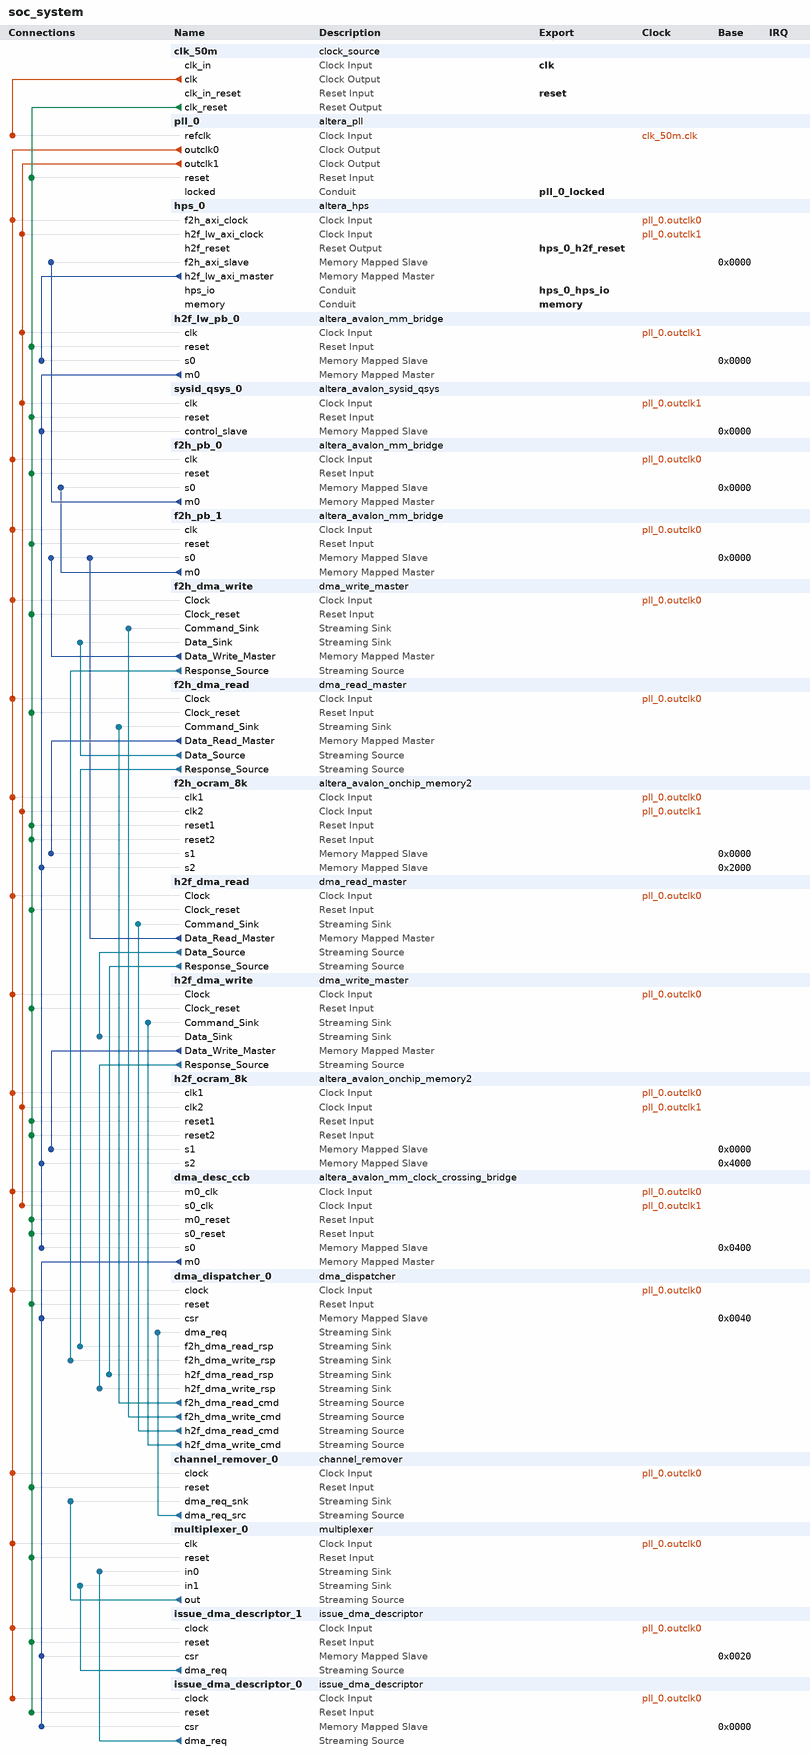
[diagram p0: system contents]
# Platform Designer (Qsys) system soc_system, Cyclone V 5CSXFC6D6F31C8ES
# Parameters at their usual value, and those the tool derives, are not listed.
package require -exact qsys 13.0
create_system soc_system
set_project_property DEVICE_FAMILY {Cyclone V}
set_project_property DEVICE 5CSXFC6D6F31C8ES

add_instance clk_50m clock_source 13.0
set_instance_parameter_value clk_50m clockFrequency 50000000

add_instance pll_0 altera_pll 13.0
set_instance_parameter_value pll_0 gui_device_speed_grade 8
set_instance_parameter_value pll_0 gui_pll_mode {Integer-N PLL}
set_instance_parameter_value pll_0 gui_reference_clock_frequency 50.0
set_instance_parameter_value pll_0 gui_operation_mode normal
set_instance_parameter_value pll_0 gui_use_locked true
set_instance_parameter_value pll_0 gui_number_of_clocks 2
set_instance_parameter_value pll_0 gui_output_clock_frequency0 150.0
set_instance_parameter_value pll_0 gui_output_clock_frequency1 131.25
set_instance_parameter_value pll_0 gui_actual_output_clock_frequency1 {140.0 MHz}
set_instance_parameter_value pll_0 gui_phase_shift_deg1 0

add_instance hps_0 altera_hps 13.0.1
set_instance_parameter_value hps_0 MEM_VENDOR JEDEC
set_instance_parameter_value hps_0 MEM_ROW_ADDR_WIDTH 15
set_instance_parameter_value hps_0 MEM_COL_ADDR_WIDTH 10
set_instance_parameter_value hps_0 MEM_DQ_WIDTH 40
set_instance_parameter_value hps_0 MEM_BANKADDR_WIDTH 3
set_instance_parameter_value hps_0 MEM_DRV_STR RZQ/6
set_instance_parameter_value hps_0 MEM_RTT_NOM RZQ/6
set_instance_parameter_value hps_0 MEM_RTT_WR {Dynamic ODT off}
set_instance_parameter_value hps_0 MEM_WTCL 6
set_instance_parameter_value hps_0 MEM_TCL 7
set_instance_parameter_value hps_0 TIMING_TIS 170
set_instance_parameter_value hps_0 TIMING_TIH 120
set_instance_parameter_value hps_0 TIMING_TDS 10
set_instance_parameter_value hps_0 TIMING_TDH 45
set_instance_parameter_value hps_0 TIMING_TDQSQ 100
set_instance_parameter_value hps_0 TIMING_TDQSCK 225
set_instance_parameter_value hps_0 TIMING_TDQSS 0.27
set_instance_parameter_value hps_0 TIMING_TQSH 0.4
set_instance_parameter_value hps_0 TIMING_TDSH 0.18
set_instance_parameter_value hps_0 TIMING_TDSS 0.18
set_instance_parameter_value hps_0 MEM_TRAS_NS 35.0
set_instance_parameter_value hps_0 MEM_TRCD_NS 13.75
set_instance_parameter_value hps_0 MEM_TRP_NS 13.75
set_instance_parameter_value hps_0 MEM_TRFC_NS 260.0
set_instance_parameter_value hps_0 MEM_TFAW_NS 30.0
set_instance_parameter_value hps_0 MEM_TRRD_NS 10.0
set_instance_parameter_value hps_0 MEM_TRTP_NS 10.0
set_instance_parameter_value hps_0 REF_CLK_FREQ 25.0
set_instance_parameter_value hps_0 DEFAULT_FAST_SIM_MODEL true
set_instance_parameter_value hps_0 TIMING_BOARD_MAX_CK_DELAY 0.6
set_instance_parameter_value hps_0 TIMING_BOARD_MAX_DQS_DELAY 0.6
set_instance_parameter_value hps_0 TIMING_BOARD_SKEW_CKDQS_DIMM_MIN -0.01
set_instance_parameter_value hps_0 TIMING_BOARD_SKEW_CKDQS_DIMM_MAX 0.01
set_instance_parameter_value hps_0 TIMING_BOARD_SKEW_WITHIN_DQS 0.02
set_instance_parameter_value hps_0 TIMING_BOARD_SKEW_BETWEEN_DQS 0.02
set_instance_parameter_value hps_0 TIMING_BOARD_DQ_TO_DQS_SKEW 0.0
set_instance_parameter_value hps_0 TIMING_BOARD_AC_SKEW 0.02
set_instance_parameter_value hps_0 TIMING_BOARD_AC_TO_CK_SKEW 0.0
set_instance_parameter_value hps_0 MEM_CLK_FREQ 400.0
set_instance_parameter_value hps_0 HPS_PROTOCOL DDR3
set_instance_parameter_value hps_0 STM_Enable false
set_instance_parameter_value hps_0 F2S_Width 3
set_instance_parameter_value hps_0 S2F_Width 0
set_instance_parameter_value hps_0 LWH2F_Enable true
set_instance_parameter_value hps_0 F2SCLK_DBGRST_Enable false
set_instance_parameter_value hps_0 F2SCLK_WARMRST_Enable false
set_instance_parameter_value hps_0 F2SCLK_COLDRST_Enable false
set_instance_parameter_value hps_0 F2SINTERRUPT_Enable false
set_instance_parameter_value hps_0 EMAC1_PinMuxing {HPS I/O Set 0}
set_instance_parameter_value hps_0 EMAC1_Mode RGMII
set_instance_parameter_value hps_0 QSPI_PinMuxing {HPS I/O Set 0}
set_instance_parameter_value hps_0 QSPI_Mode {1 SS}
set_instance_parameter_value hps_0 SDIO_PinMuxing {HPS I/O Set 0}
set_instance_parameter_value hps_0 SDIO_Mode {4-bit Data}
set_instance_parameter_value hps_0 USB1_PinMuxing {HPS I/O Set 0}
set_instance_parameter_value hps_0 USB1_Mode SDR
set_instance_parameter_value hps_0 SPIM0_PinMuxing {HPS I/O Set 0}
set_instance_parameter_value hps_0 SPIM0_Mode {Single Slave Select}
set_instance_parameter_value hps_0 SPIM1_PinMuxing Unused
set_instance_parameter_value hps_0 SPIM1_Mode N/A
set_instance_parameter_value hps_0 UART0_PinMuxing {HPS I/O Set 2}
set_instance_parameter_value hps_0 UART0_Mode {No Flow Control}
set_instance_parameter_value hps_0 I2C0_PinMuxing {HPS I/O Set 1}
set_instance_parameter_value hps_0 I2C0_Mode I2C
set_instance_parameter_value hps_0 I2C1_PinMuxing Unused
set_instance_parameter_value hps_0 I2C1_Mode N/A
set_instance_parameter_value hps_0 CAN0_PinMuxing {HPS I/O Set 0}
set_instance_parameter_value hps_0 CAN0_Mode CAN
set_instance_parameter_value hps_0 TRACE_PinMuxing {HPS I/O Set 0}
set_instance_parameter_value hps_0 TRACE_Mode HPS
set_instance_parameter_value hps_0 S2FCLK_USER1CLK_FREQ 100
set_instance_parameter_value hps_0 FPGA_PERIPHERAL_OUTPUT_CLOCK_FREQ_EMAC0_MD_CLK 100
set_instance_parameter_value hps_0 FPGA_PERIPHERAL_OUTPUT_CLOCK_FREQ_EMAC0_GTX_CLK 100
set_instance_parameter_value hps_0 FPGA_PERIPHERAL_OUTPUT_CLOCK_FREQ_EMAC1_MD_CLK 100
set_instance_parameter_value hps_0 FPGA_PERIPHERAL_OUTPUT_CLOCK_FREQ_EMAC1_GTX_CLK 100
set_instance_parameter_value hps_0 quartus_ini_hps_ip_enable_loanio false

add_instance h2f_lw_pb_0 altera_avalon_mm_bridge 13.0
set_instance_parameter_value h2f_lw_pb_0 DATA_WIDTH 32
set_instance_parameter_value h2f_lw_pb_0 ADDRESS_WIDTH 16
set_instance_parameter_value h2f_lw_pb_0 ADDRESS_UNITS SYMBOLS
set_instance_parameter_value h2f_lw_pb_0 MAX_PENDING_RESPONSES 32

add_instance sysid_qsys_0 altera_avalon_sysid_qsys 13.0
set_instance_parameter_value sysid_qsys_0 id 1297045074

add_instance f2h_pb_0 altera_avalon_mm_bridge 13.0
set_instance_parameter_value f2h_pb_0 DATA_WIDTH 128
set_instance_parameter_value f2h_pb_0 ADDRESS_WIDTH 32
set_instance_parameter_value f2h_pb_0 ADDRESS_UNITS SYMBOLS
set_instance_parameter_value f2h_pb_0 MAX_BURST_SIZE 16
set_instance_parameter_value f2h_pb_0 MAX_PENDING_RESPONSES 32

add_instance f2h_pb_1 altera_avalon_mm_bridge 13.0
set_instance_parameter_value f2h_pb_1 DATA_WIDTH 128
set_instance_parameter_value f2h_pb_1 ADDRESS_WIDTH 32
set_instance_parameter_value f2h_pb_1 ADDRESS_UNITS SYMBOLS
set_instance_parameter_value f2h_pb_1 MAX_BURST_SIZE 16
set_instance_parameter_value f2h_pb_1 MAX_PENDING_RESPONSES 32

add_instance f2h_dma_write dma_write_master 1.0
set_instance_parameter_value f2h_dma_write DATA_WIDTH 128
set_instance_parameter_value f2h_dma_write LENGTH_WIDTH 16
set_instance_parameter_value f2h_dma_write FIFO_DEPTH 256
set_instance_parameter_value f2h_dma_write STRIDE_ENABLE 0
set_instance_parameter_value f2h_dma_write GUI_STRIDE_WIDTH 1
set_instance_parameter_value f2h_dma_write BURST_ENABLE 1
set_instance_parameter_value f2h_dma_write GUI_MAX_BURST_COUNT 16
set_instance_parameter_value f2h_dma_write GUI_PROGRAMMABLE_BURST_ENABLE 0
set_instance_parameter_value f2h_dma_write GUI_BURST_WRAPPING_SUPPORT 0
set_instance_parameter_value f2h_dma_write TRANSFER_TYPE {Full Word Accesses Only}
set_instance_parameter_value f2h_dma_write PACKET_ENABLE 0
set_instance_parameter_value f2h_dma_write ERROR_ENABLE 0
set_instance_parameter_value f2h_dma_write ERROR_WIDTH 8
set_instance_parameter_value f2h_dma_write ADDRESS_WIDTH 32
set_instance_parameter_value f2h_dma_write FIFO_SPEED_OPTIMIZATION 1

add_instance f2h_dma_read dma_read_master 1.0
set_instance_parameter_value f2h_dma_read DATA_WIDTH 128
set_instance_parameter_value f2h_dma_read LENGTH_WIDTH 16
set_instance_parameter_value f2h_dma_read FIFO_DEPTH 256
set_instance_parameter_value f2h_dma_read STRIDE_ENABLE 0
set_instance_parameter_value f2h_dma_read GUI_STRIDE_WIDTH 1
set_instance_parameter_value f2h_dma_read BURST_ENABLE 0
set_instance_parameter_value f2h_dma_read GUI_MAX_BURST_COUNT 2
set_instance_parameter_value f2h_dma_read GUI_PROGRAMMABLE_BURST_ENABLE 0
set_instance_parameter_value f2h_dma_read GUI_BURST_WRAPPING_SUPPORT 1
set_instance_parameter_value f2h_dma_read TRANSFER_TYPE {Full Word Accesses Only}
set_instance_parameter_value f2h_dma_read PACKET_ENABLE 0
set_instance_parameter_value f2h_dma_read ERROR_ENABLE 0
set_instance_parameter_value f2h_dma_read ERROR_WIDTH 8
set_instance_parameter_value f2h_dma_read CHANNEL_ENABLE 0
set_instance_parameter_value f2h_dma_read CHANNEL_WIDTH 8
set_instance_parameter_value f2h_dma_read ADDRESS_WIDTH 13
set_instance_parameter_value f2h_dma_read FIFO_SPEED_OPTIMIZATION 1

add_instance f2h_ocram_8k altera_avalon_onchip_memory2 13.0.1.99.2
set_instance_parameter_value f2h_ocram_8k dataWidth 128
set_instance_parameter_value f2h_ocram_8k dualPort true
set_instance_parameter_value f2h_ocram_8k initMemContent true
set_instance_parameter_value f2h_ocram_8k initializationFileName onchip_mem.hex
set_instance_parameter_value f2h_ocram_8k memorySize 8192

add_instance h2f_dma_read dma_read_master 1.0
set_instance_parameter_value h2f_dma_read DATA_WIDTH 128
set_instance_parameter_value h2f_dma_read LENGTH_WIDTH 16
set_instance_parameter_value h2f_dma_read FIFO_DEPTH 256
set_instance_parameter_value h2f_dma_read STRIDE_ENABLE 0
set_instance_parameter_value h2f_dma_read GUI_STRIDE_WIDTH 1
set_instance_parameter_value h2f_dma_read BURST_ENABLE 1
set_instance_parameter_value h2f_dma_read GUI_MAX_BURST_COUNT 16
set_instance_parameter_value h2f_dma_read GUI_PROGRAMMABLE_BURST_ENABLE 0
set_instance_parameter_value h2f_dma_read GUI_BURST_WRAPPING_SUPPORT 0
set_instance_parameter_value h2f_dma_read TRANSFER_TYPE {Full Word Accesses Only}
set_instance_parameter_value h2f_dma_read PACKET_ENABLE 0
set_instance_parameter_value h2f_dma_read ERROR_ENABLE 0
set_instance_parameter_value h2f_dma_read ERROR_WIDTH 8
set_instance_parameter_value h2f_dma_read CHANNEL_ENABLE 0
set_instance_parameter_value h2f_dma_read CHANNEL_WIDTH 8
set_instance_parameter_value h2f_dma_read ADDRESS_WIDTH 32
set_instance_parameter_value h2f_dma_read FIFO_SPEED_OPTIMIZATION 1

add_instance h2f_dma_write dma_write_master 1.0
set_instance_parameter_value h2f_dma_write DATA_WIDTH 128
set_instance_parameter_value h2f_dma_write LENGTH_WIDTH 16
set_instance_parameter_value h2f_dma_write FIFO_DEPTH 256
set_instance_parameter_value h2f_dma_write STRIDE_ENABLE 0
set_instance_parameter_value h2f_dma_write GUI_STRIDE_WIDTH 1
set_instance_parameter_value h2f_dma_write BURST_ENABLE 0
set_instance_parameter_value h2f_dma_write GUI_MAX_BURST_COUNT 16
set_instance_parameter_value h2f_dma_write GUI_PROGRAMMABLE_BURST_ENABLE 0
set_instance_parameter_value h2f_dma_write GUI_BURST_WRAPPING_SUPPORT 1
set_instance_parameter_value h2f_dma_write TRANSFER_TYPE {Full Word Accesses Only}
set_instance_parameter_value h2f_dma_write PACKET_ENABLE 0
set_instance_parameter_value h2f_dma_write ERROR_ENABLE 0
set_instance_parameter_value h2f_dma_write ERROR_WIDTH 8
set_instance_parameter_value h2f_dma_write ADDRESS_WIDTH 13
set_instance_parameter_value h2f_dma_write FIFO_SPEED_OPTIMIZATION 1

add_instance h2f_ocram_8k altera_avalon_onchip_memory2 13.0.1.99.2
set_instance_parameter_value h2f_ocram_8k dataWidth 128
set_instance_parameter_value h2f_ocram_8k dualPort true
set_instance_parameter_value h2f_ocram_8k initMemContent true
set_instance_parameter_value h2f_ocram_8k initializationFileName onchip_mem.hex
set_instance_parameter_value h2f_ocram_8k memorySize 8192

add_instance dma_desc_ccb altera_avalon_mm_clock_crossing_bridge 13.0
set_instance_parameter_value dma_desc_ccb DATA_WIDTH 32
set_instance_parameter_value dma_desc_ccb ADDRESS_WIDTH 8
set_instance_parameter_value dma_desc_ccb MAX_BURST_SIZE 1
set_instance_parameter_value dma_desc_ccb COMMAND_FIFO_DEPTH 128
set_instance_parameter_value dma_desc_ccb RESPONSE_FIFO_DEPTH 128
set_instance_parameter_value dma_desc_ccb MASTER_SYNC_DEPTH 2
set_instance_parameter_value dma_desc_ccb SLAVE_SYNC_DEPTH 2

add_instance dma_dispatcher_0 dma_dispatcher 1.0

add_instance channel_remover_0 channel_remover 1.0

add_instance multiplexer_0 multiplexer 13.0
set_instance_parameter_value multiplexer_0 bitsPerSymbol 128
set_instance_parameter_value multiplexer_0 errorWidth 0
set_instance_parameter_value multiplexer_0 generationLanguage VERILOG
set_instance_parameter_value multiplexer_0 numInputInterfaces 2
set_instance_parameter_value multiplexer_0 outChannelWidth 1
set_instance_parameter_value multiplexer_0 packetScheduling false
set_instance_parameter_value multiplexer_0 schedulingSize 1
set_instance_parameter_value multiplexer_0 symbolsPerBeat 1
set_instance_parameter_value multiplexer_0 useHighBitsOfChannel true
set_instance_parameter_value multiplexer_0 usePackets false

add_instance issue_dma_descriptor_1 issue_dma_descriptor 1.0

add_instance issue_dma_descriptor_0 issue_dma_descriptor 1.0

# connections
add_connection clk_50m.clk pll_0.refclk clock
add_connection pll_0.outclk0 channel_remover_0.clock clock
add_connection pll_0.outclk0 dma_desc_ccb.m0_clk clock
add_connection pll_0.outclk0 dma_dispatcher_0.clock clock
add_connection pll_0.outclk0 f2h_dma_read.Clock clock
add_connection pll_0.outclk0 f2h_dma_write.Clock clock
add_connection pll_0.outclk0 f2h_ocram_8k.clk1 clock
add_connection pll_0.outclk0 f2h_pb_0.clk clock
add_connection pll_0.outclk0 f2h_pb_1.clk clock
add_connection pll_0.outclk0 h2f_dma_read.Clock clock
add_connection pll_0.outclk0 h2f_dma_write.Clock clock
add_connection pll_0.outclk0 h2f_ocram_8k.clk1 clock
add_connection pll_0.outclk0 hps_0.f2h_axi_clock clock
add_connection pll_0.outclk0 issue_dma_descriptor_0.clock clock
add_connection pll_0.outclk0 issue_dma_descriptor_1.clock clock
add_connection pll_0.outclk0 multiplexer_0.clk clock
add_connection pll_0.outclk1 dma_desc_ccb.s0_clk clock
add_connection pll_0.outclk1 f2h_ocram_8k.clk2 clock
add_connection pll_0.outclk1 h2f_lw_pb_0.clk clock
add_connection pll_0.outclk1 h2f_ocram_8k.clk2 clock
add_connection pll_0.outclk1 hps_0.h2f_lw_axi_clock clock
add_connection pll_0.outclk1 sysid_qsys_0.clk clock
add_connection clk_50m.clk_reset channel_remover_0.reset reset
add_connection clk_50m.clk_reset dma_desc_ccb.m0_reset reset
add_connection clk_50m.clk_reset dma_desc_ccb.s0_reset reset
add_connection clk_50m.clk_reset dma_dispatcher_0.reset reset
add_connection clk_50m.clk_reset f2h_dma_read.Clock_reset reset
add_connection clk_50m.clk_reset f2h_dma_write.Clock_reset reset
add_connection clk_50m.clk_reset f2h_ocram_8k.reset1 reset
add_connection clk_50m.clk_reset f2h_ocram_8k.reset2 reset
add_connection clk_50m.clk_reset f2h_pb_0.reset reset
add_connection clk_50m.clk_reset f2h_pb_1.reset reset
add_connection clk_50m.clk_reset h2f_dma_read.Clock_reset reset
add_connection clk_50m.clk_reset h2f_dma_write.Clock_reset reset
add_connection clk_50m.clk_reset h2f_lw_pb_0.reset reset
add_connection clk_50m.clk_reset h2f_ocram_8k.reset1 reset
add_connection clk_50m.clk_reset h2f_ocram_8k.reset2 reset
add_connection clk_50m.clk_reset issue_dma_descriptor_0.reset reset
add_connection clk_50m.clk_reset issue_dma_descriptor_1.reset reset
add_connection clk_50m.clk_reset multiplexer_0.reset reset
add_connection clk_50m.clk_reset pll_0.reset reset
add_connection clk_50m.clk_reset sysid_qsys_0.reset reset
add_connection dma_desc_ccb.m0 dma_dispatcher_0.csr avalon
set_connection_parameter_value dma_desc_ccb.m0/dma_dispatcher_0.csr baseAddress 0x0040
add_connection dma_desc_ccb.m0 issue_dma_descriptor_0.csr avalon
set_connection_parameter_value dma_desc_ccb.m0/issue_dma_descriptor_0.csr baseAddress 0x0000
add_connection dma_desc_ccb.m0 issue_dma_descriptor_1.csr avalon
set_connection_parameter_value dma_desc_ccb.m0/issue_dma_descriptor_1.csr baseAddress 0x0020
add_connection f2h_dma_read.Data_Read_Master f2h_ocram_8k.s1 avalon
set_connection_parameter_value f2h_dma_read.Data_Read_Master/f2h_ocram_8k.s1 baseAddress 0x0000
add_connection f2h_dma_write.Data_Write_Master f2h_pb_1.s0 avalon
set_connection_parameter_value f2h_dma_write.Data_Write_Master/f2h_pb_1.s0 baseAddress 0x0000
add_connection f2h_pb_0.m0 hps_0.f2h_axi_slave avalon
set_connection_parameter_value f2h_pb_0.m0/hps_0.f2h_axi_slave baseAddress 0x0000
add_connection f2h_pb_1.m0 f2h_pb_0.s0 avalon
set_connection_parameter_value f2h_pb_1.m0/f2h_pb_0.s0 baseAddress 0x0000
add_connection h2f_dma_read.Data_Read_Master f2h_pb_1.s0 avalon
set_connection_parameter_value h2f_dma_read.Data_Read_Master/f2h_pb_1.s0 arbitrationPriority 64
set_connection_parameter_value h2f_dma_read.Data_Read_Master/f2h_pb_1.s0 baseAddress 0x0000
add_connection h2f_dma_write.Data_Write_Master h2f_ocram_8k.s1 avalon
set_connection_parameter_value h2f_dma_write.Data_Write_Master/h2f_ocram_8k.s1 baseAddress 0x0000
add_connection h2f_lw_pb_0.m0 dma_desc_ccb.s0 avalon
set_connection_parameter_value h2f_lw_pb_0.m0/dma_desc_ccb.s0 baseAddress 0x0400
add_connection h2f_lw_pb_0.m0 f2h_ocram_8k.s2 avalon
set_connection_parameter_value h2f_lw_pb_0.m0/f2h_ocram_8k.s2 baseAddress 0x2000
add_connection h2f_lw_pb_0.m0 h2f_ocram_8k.s2 avalon
set_connection_parameter_value h2f_lw_pb_0.m0/h2f_ocram_8k.s2 baseAddress 0x4000
add_connection h2f_lw_pb_0.m0 sysid_qsys_0.control_slave avalon
set_connection_parameter_value h2f_lw_pb_0.m0/sysid_qsys_0.control_slave baseAddress 0x0000
add_connection hps_0.h2f_lw_axi_master h2f_lw_pb_0.s0 avalon
set_connection_parameter_value hps_0.h2f_lw_axi_master/h2f_lw_pb_0.s0 baseAddress 0x0000
add_connection channel_remover_0.dma_req_src dma_dispatcher_0.dma_req avalon_streaming
add_connection dma_dispatcher_0.f2h_dma_read_cmd f2h_dma_read.Command_Sink avalon_streaming
add_connection dma_dispatcher_0.f2h_dma_write_cmd f2h_dma_write.Command_Sink avalon_streaming
add_connection dma_dispatcher_0.h2f_dma_read_cmd h2f_dma_read.Command_Sink avalon_streaming
add_connection dma_dispatcher_0.h2f_dma_write_cmd h2f_dma_write.Command_Sink avalon_streaming
add_connection f2h_dma_read.Data_Source f2h_dma_write.Data_Sink avalon_streaming
add_connection f2h_dma_read.Response_Source dma_dispatcher_0.f2h_dma_read_rsp avalon_streaming
add_connection f2h_dma_write.Response_Source dma_dispatcher_0.f2h_dma_write_rsp avalon_streaming
add_connection h2f_dma_read.Data_Source h2f_dma_write.Data_Sink avalon_streaming
add_connection h2f_dma_read.Response_Source dma_dispatcher_0.h2f_dma_read_rsp avalon_streaming
add_connection h2f_dma_write.Response_Source dma_dispatcher_0.h2f_dma_write_rsp avalon_streaming
add_connection issue_dma_descriptor_0.dma_req multiplexer_0.in0 avalon_streaming
add_connection issue_dma_descriptor_1.dma_req multiplexer_0.in1 avalon_streaming
add_connection multiplexer_0.out channel_remover_0.dma_req_snk avalon_streaming

# exported interfaces
add_interface memory conduit end
set_interface_property memory EXPORT_OF hps_0.memory
add_interface hps_0_hps_io conduit end
set_interface_property hps_0_hps_io EXPORT_OF hps_0.hps_io
add_interface hps_0_h2f_reset reset source
set_interface_property hps_0_h2f_reset EXPORT_OF hps_0.h2f_reset
add_interface reset reset sink
set_interface_property reset EXPORT_OF clk_50m.clk_in_reset
add_interface clk clock sink
set_interface_property clk EXPORT_OF clk_50m.clk_in
add_interface pll_0_locked conduit end
set_interface_property pll_0_locked EXPORT_OF pll_0.locked

set_interconnect_requirement {$system} qsys_mm.clockCrossingAdapter HANDSHAKE
set_interconnect_requirement {$system} qsys_mm.maxAdditionalLatency 4
set_interconnect_requirement hps_only_master.master qsys_mm.security SECURE
set_interconnect_requirement f2h_pb_0.m0 qsys_mm.security SECURE

save_system soc_system.qsys
